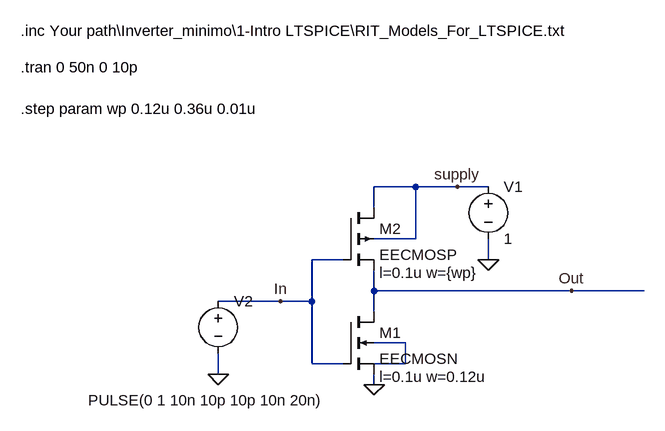
[diagram p0: schematic Inverter_min_senza_carico.asc]
Inverter_min_senza_carico.asc, the LTspice schematic file:
Version 4
SHEET 1 1776 680
WIRE 288 0 224 0
WIRE 352 0 288 0
WIRE 400 0 352 0
WIRE 224 32 224 0
WIRE 288 80 288 0
WIRE 288 80 224 80
WIRE 176 112 128 112
WIRE 400 112 400 80
WIRE 224 160 224 128
WIRE 528 160 224 160
WIRE 640 160 528 160
WIRE 80 176 -16 176
WIRE 128 176 128 112
WIRE 128 176 80 176
WIRE 224 192 224 160
WIRE 272 240 224 240
WIRE 128 272 128 176
WIRE 176 272 128 272
WIRE 272 272 272 240
WIRE 272 272 224 272
WIRE -16 288 -16 256
WIRE 224 304 224 288
FLAG 224 304 0
FLAG 400 112 0
FLAG -16 288 0
FLAG 80 176 In
FLAG 352 0 supply
FLAG 528 160 Out
SYMBOL nmos4 176 192 R0
WINDOW 123 56 100 Left 2
SYMATTR Value2 l=0.1u w=0.12u
SYMATTR InstName M1
SYMATTR Value EECMOSN
SYMBOL pmos4 176 32 R0
WINDOW 123 56 100 Left 2
SYMATTR Value2 l=0.1u w={wp}
SYMATTR InstName M2
SYMATTR Value EECMOSP
SYMBOL voltage 400 -16 R0
WINDOW 123 0 0 Left 0
WINDOW 39 0 0 Left 0
SYMATTR InstName V1
SYMATTR Value 1
SYMBOL voltage -16 160 R0
WINDOW 3 -200 168 Left 2
WINDOW 123 0 0 Left 0
WINDOW 39 0 0 Left 0
SYMATTR Value PULSE(0 1 10n 10p 10p 10n 20n)
SYMATTR InstName V2
TEXT -320 -184 Left 2 !.tran 0 50n 0 10p
TEXT -320 -240 Left 2 !.inc Your path\\Inverter_minimo\\1-Intro LTSPICE\\RIT_Models_For_LTSPICE.txt
TEXT -320 -120 Left 2 !.step param wp 0.12u 0.36u 0.01u

The netlist it stands for:
* Inverter_min_senza_carico.asc
M1 Out In 0 N001 EECMOSN l=0.1u w=0.12u
M2 supply In Out supply EECMOSP l=0.1u w={wp}
V1 supply 0 1
V2 In 0 PULSE(0 1 10n 10p 10p 10n 20n)
.model NMOS NMOS
.model PMOS PMOS
.lib standard.mos
.tran 0 50n 0 10p
.inc Your path\Inverter_minimo\1-Intro LTSPICE\RIT_Models_For_LTSPICE.txt
.step param wp 0.12u 0.36u 0.01u
.backanno
.end